# EAGLE design LoRa ST Sensor Node v1.2 (EAGLE 7.5.0)
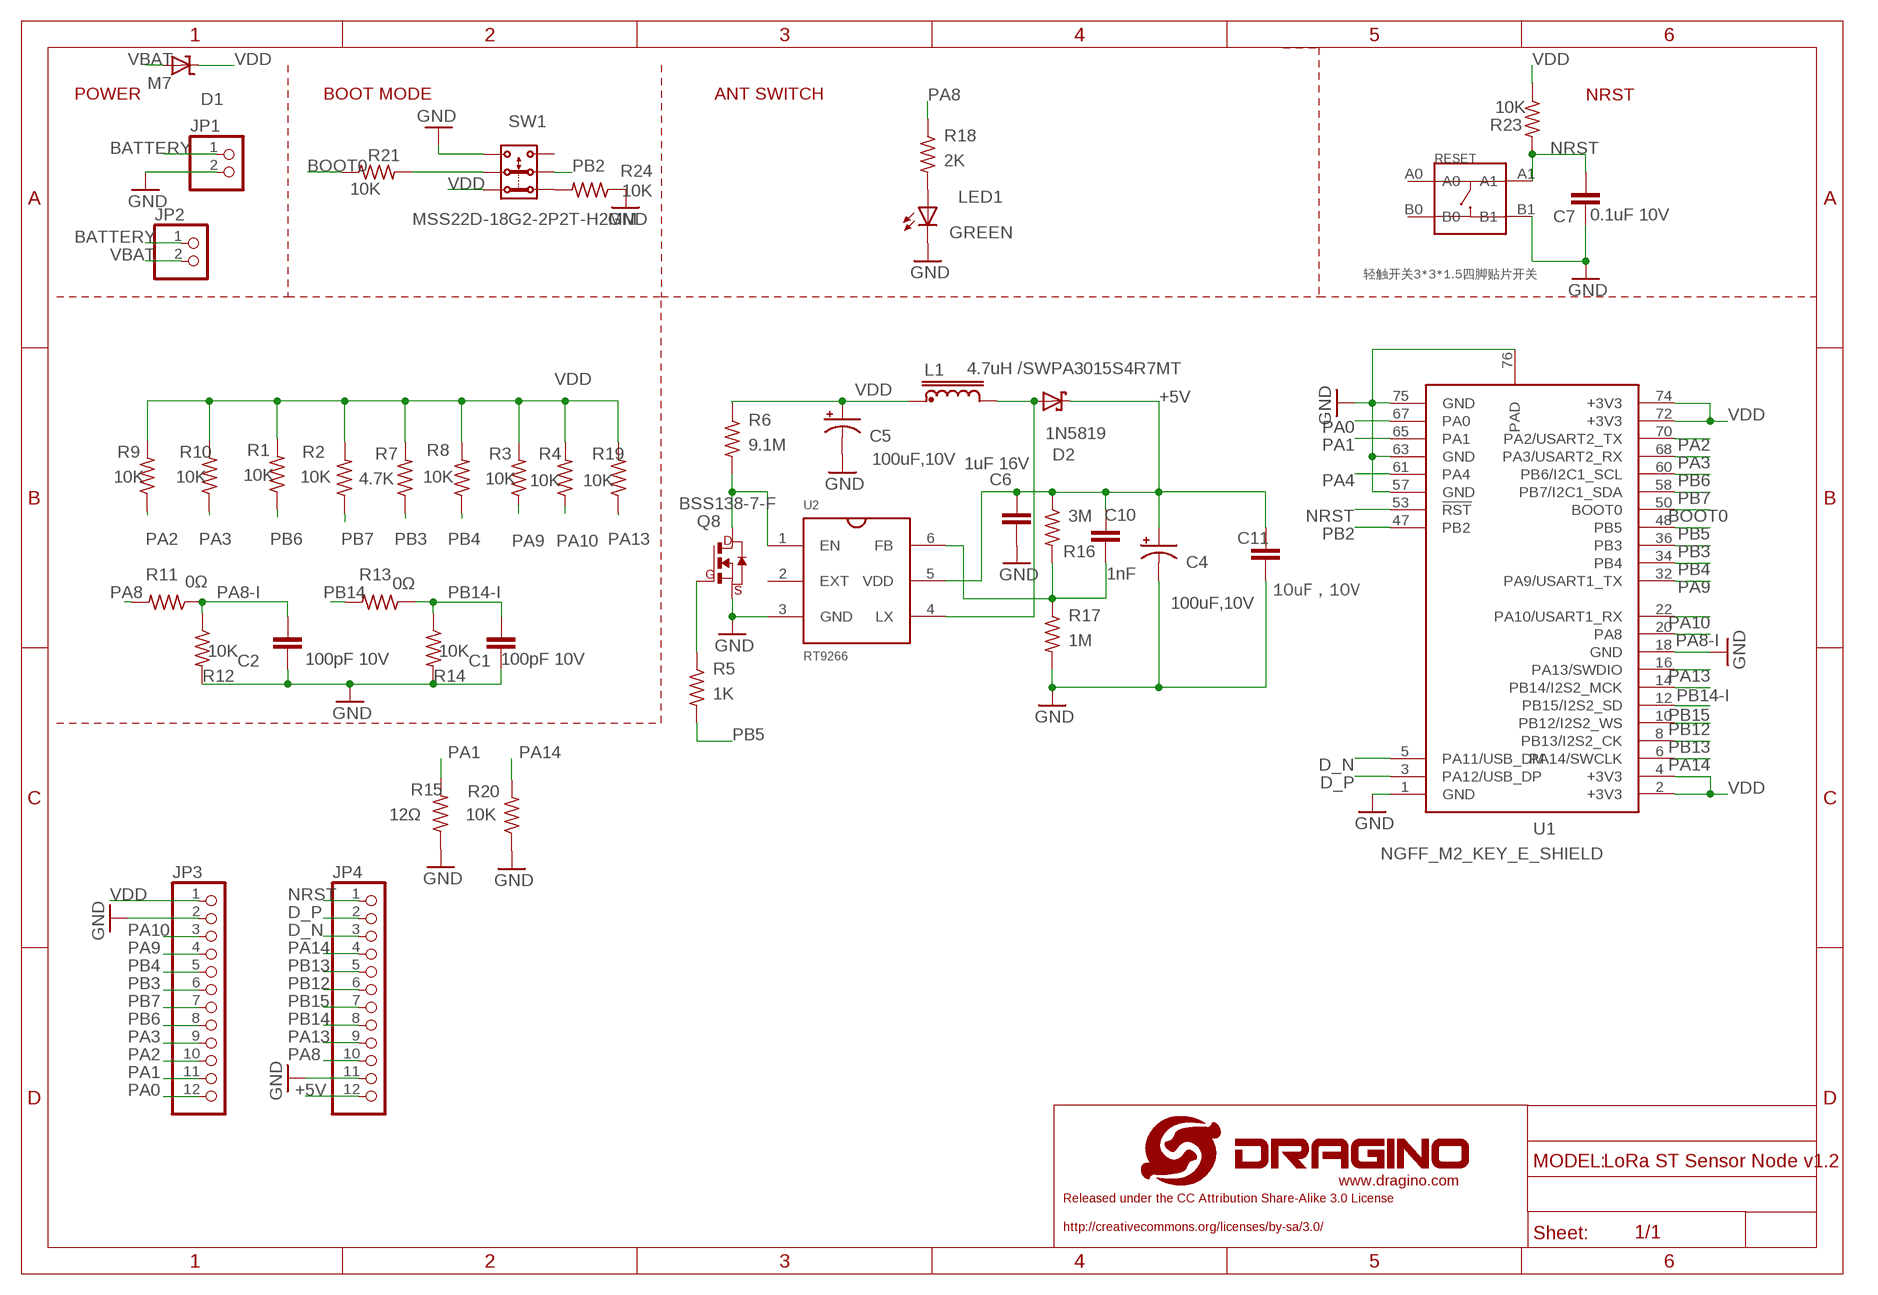
[diagram p0: schematic, sheet 1]

## Parts
C1  100pF 10V  C-EUC0603  [C0603]
C2  100pF 10V  C-EUC0603  [C0603]
C4  100uF,10V  CPOL-USSMCB  [SMC_B]
C5  100uF,10V  CPOL-USSMCB  [SMC_B]
C6  1uF 16V  C-EUC0603  [C0603]
C7  0.1uF 10V  C-EUC0402  [C0402]
C10  1nF  C-EUC0402  [C0402]
C11  10uF，10V  C-EUC0805  [C0805]
D1  M7  SCHOTTKYSMBG  [DO214AC]
D2  1N5819  SMF5.0AT1  [SOD123FL]
JP1  PINHD-1X2L  [XH2.54-2P-L]
JP2  PINHD-1X2  [1X02]
JP3  PINHD-1X12""  [1X12-DIP]
JP4  PINHD-1X12""  [1X12-DIP]
L1  4.7uH /SWPA3015S4R7MT  INDUCTORSWPA3010S  [SWPA3010S]
LED1  GREEN  LEDCHIPLED_0603  [CHIPLED_0603]
Q8  BSS138-7-F  NMOSFET  [SOT-23]
R1  10K  R-US_R0402  [R0402]
R2  10K  R-US_R0402  [R0402]
R3  10K  R-US_R0402  [R0402]
R4  10K  R-US_R0402  [R0402]
R5  1K  R-US_R0402  [R0402]
R6  9.1M  R-US_R0402  [R0402]
R7  4.7K  R-US_R0402  [R0402]
R8  10K  R-US_R0402  [R0402]
R9  10K  R-US_R0402  [R0402]
R10  10K  R-US_R0402  [R0402]
R11  0Ω  R-US_R0603  [R0603]
R12  10K  R-US_R0603  [R0603]
R13  0Ω  R-US_R0603  [R0603]
R14  10K  R-US_R0603  [R0603]
R15  12Ω  R-US_R1206  [R1206]
R16  3M  R-US_R0402  [R0402]
R17  1M  R-US_R0402  [R0402]
R18  2K  R-US_R0402  [R0402]
R19  10K  R-US_R0402  [R0402]
R20  10K  R-US_R0402  [R0402]
R21  10K  R-US_R0402  [R0402]
R23  10K  R-US_R0402  [R0402]
R24  10K  R-US_R0402  [R0402]
RESET  轻触开关3*3*1.5四脚贴片开关  BUTTON-4P-3.3X3.3  [SW4-SMD-3.35X3.35X1.5MM]
SW1  MSS22D-18G2-2P2T-H2MM  [MSS22D-18G2-2P2T-H2MM-DIL]
U1  NGFF_M2_KEY_E_SHIELD  [NGFF_M2_KEY_E_SHIELD]
U2  RT9266  [6/SOT-23]

## Nets
+5V: C4.+ C6.2 C10.2 C11.2 D2.C JP4.12 R16.1 U2.5(VDD)
BATTERY: JP1.1 JP2.1
BOOT0: R21.1 U1.50(BOOT0)
D_N: JP4.3 U1.5(PA11/USB_DM)
D_P: JP4.2 U1.3(PA12/USB_DP)
GND: C1.1 C2.1 C4.- C5.- C6.1 C7.1 C11.1 JP1.2 JP3.2 JP4.11 LED1.C Q8.2(S) R12.2 R14.2 R15.1 R17.2 R20.1 R24.1 RESET.B1 SW1.1 U1.1(GND) U1.18(GND) U1.57(GND) U1.63(GND) U1.75(GND) U1.76(PAD) U2.3(GND)
N$3: LED1.A R18.2
N$4: R24.2 SW1.4
N$5: Q8.3(G) R5.1
N$6: C10.1 R16.2 R17.1 U2.6(FB)
N$7: D2.A L1.P$2 U2.4(LX)
N$9: Q8.1(D) R6.2 U2.1(EN)
N$22: R21.2 SW1.2
NRST: C7.2 JP4.1 R23.2 RESET.A1 U1.53(!RST)
PA0: JP3.12 U1.67(PA0)
PA1: JP3.11 R15.2 U1.65(PA1)
PA2: JP3.10 R9.1 U1.70(PA2/USART2_TX)
PA3: JP3.9 R10.1 U1.68(PA3/USART2_RX)
PA4: U1.61(PA4)
PA8: JP4.10 R11.2 R18.1
PA8-I: C2.2 R11.1 R12.1 U1.20(PA8)
PA9: JP3.4 R3.1 U1.32(PA9/USART1_TX)
PA10: JP3.3 R4.1 U1.22(PA10/USART1_RX)
PA13: JP4.9 R19.1 U1.16(PA13/SWDIO)
PA14: JP4.4 R20.2 U1.6(PA14/SWCLK)
PB2: SW1.5 U1.47(PB2)
PB3: JP3.6 R7.1 U1.36(PB3)
PB4: JP3.5 R8.1 U1.34(PB4)
PB5: R5.2 U1.48(PB5)
PB6: JP3.8 R1.1 U1.60(PB6/I2C1_SCL)
PB7: JP3.7 R2.1 U1.58(PB7/I2C1_SDA)
PB12: JP4.6 U1.10(PB12/I2S2_WS)
PB13: JP4.5 U1.8(PB13/I2S2_CK)
PB14: JP4.8 R13.2
PB14-I: C1.2 R13.1 R14.1 U1.14(PB14/I2S2_MCK)
PB15: JP4.7 U1.12(PB15/I2S2_SD)
VBAT: D1.A JP2.2
VDD: C5.+ D1.C JP3.1 L1.P$1 R1.2 R2.2 R3.2 R4.2 R6.1 R7.2 R8.2 R9.2 R10.2 R19.2 R23.1 SW1.3 U1.2(+3V3) U1.4(+3V3) U1.72(+3V3) U1.74(+3V3)
Unconnected: RESET.A0 RESET.B0 SW1.6 U2.2(EXT)

## Notes on the sheet
- NRST
- POWER | BOOT MODE | ANT SWITCH

## Library data of the parts
C1 C2 C6 C7 C10 = dragino:C-EU: CAPACITOR, European symbol
C4 C5 = rcl:CPOL-US: POLARIZED CAPACITOR, American symbol
C11 = dragino-passive:C-EU: CAPACITOR, European symbol
D1 = dragino:SCHOTTKY: Suppressor diode; OC_FARNELL: unknown
D2 = diode:SMF5.0AT1: 200 W Transient Voltage Suppressor Source: Data sheet <http://www.onsemi.com/pub_link/Collateral/SMF5.0AT1-D.PDF>
JP1 JP2 = pinhead:PINHD-1X2: PIN HEADER
JP3 JP4 = pinhead:PINHD-1X12: PIN HEADER
L1 = dragino:INDUCTOR: CHOKE U15
LED1 = dragino:LED: LED OSRAM: - CHIPLED LG R971, LG N971, LY N971, LG Q971, LY Q971, LO R971, LY R971 LH N974, LH R974 LS Q976, LO Q976, LY Q976 LO Q996 - Hyper CHIPLED LW Q18S LB Q993, LB Q99A, LB R99A - SideLED LS A670, LO A670, LY A670, LG A670, LP A670 LB A673, LV A673, LT A673, LW A673 LH A674 LY A675 LS A676, LA A676, LO A676, LY A676, LW A676 LS A679, LY A679, LG A679 - Hyper Micro SIDELED® LS Y876, LA Y876, LO Y876, LY Y876 LT Y87S - SmartLED LW L88C, LW L88S LB L89C, LB L89S, LG L890 LS L89K, LO L89K, LY L89K LS L896, LA L896, LO L896, LY L896 - TOPLED LS T670, LO T670, LY T670, LG T670, LP T670 LSG T670, LSP T670, LSY T670, LOP T670, LYG T670 LG T671, LOG T671, LSG T671 LB T673, LV T673, LT T673, LW T673 LH T674 LS T676, LA T676, LO T676, LY T676, LB T676, LH T676, LSB T676, LW T676 LB T67C, LV T67C, LT T67C, LS T67K, LO T67K, LY T67K, LW E67C LS E67B, LA E67B, LO E67B, LY E67B, LB E67C, LV E67C, LT E67C LW T67C LS T679, LY T679, LG T679 LS T770, LO T770, LY T770, LG T770, LP T770 LB T773, LV T773, LT T773, LW T773 LH T774 LS E675, LA E675, LY E675, LS T675 LS T776, LA T776, LO T776, LY T776, LB T776 LHGB T686 LT T68C, LB T68C - Hyper Mini TOPLED® LB M676 - Mini TOPLED Santana® LG M470 LS M47K, LO M47K, LY M47K Source: http://www.osram.convergy.de LUXEON: - LUMILED® LXK2-PW12-R00, LXK2-PW12-S00, LXK2-PW14-U00, LXK2-PW14-V00 LXK2-PM12-R00, LXK2-PM12-S00, LXK2-PM14-U00 LXK2-PE12-Q00, LXK2-PE12-R00, LXK2-PE12-S00, LXK2-PE14-T00, LXK2-PE14-U00 LXK2-PB12-K00, LXK2-PB12-L00, LXK2-PB12-M00, LXK2-PB14-N00, LXK2-PB14-P00, LXK2-PB14-Q00 LXK2-PR12-L00, LXK2-PR12-M00, LXK2-PR14-Q00, LXK2-PR14-R00 LXK2-PD12-Q00, LXK2-PD12-R00, LXK2-PD12-S00 LXK2-PH12-R00, LXK2-PH12-S00 LXK2-PL12-P00, LXK2-PL12-Q00, LXK2-PL12-R00 Source: www.luxeon.com KINGBRIGHT: KA-3528ASYC Source: www.kingbright.com
Q8 = dragino:NMOSFET: MOS FET; OC_FARNELL: unknown; OC_NEWARK: unknown
R1-R21 R23 R24 = dragino:R-US_: RESISTOR, American symbol
RESET = dragino:BUTTON-4P: SW4-6.0X6.0X5.0MM:311020024;SW4-8.0X8.0X9.0MM:311020028;SW4-SMD-6.0X6.0X5.0MM:311020004;SW4-SMD-3.35X3.35X1.5MM:311020030;SW4-SMD-5.2X5.2X2.5MM:311020046
SW1 = dragino:MSS22D-18G2-2P2T-H2MM
U1 = dragino:NGFF_M2_KEY_E_SHIELD
U2 = dragino:RT9266

## Net classes
0 default: width 0.203 mm, clearance 0.203 mm
1 vcc: width 0.254 mm

## Board
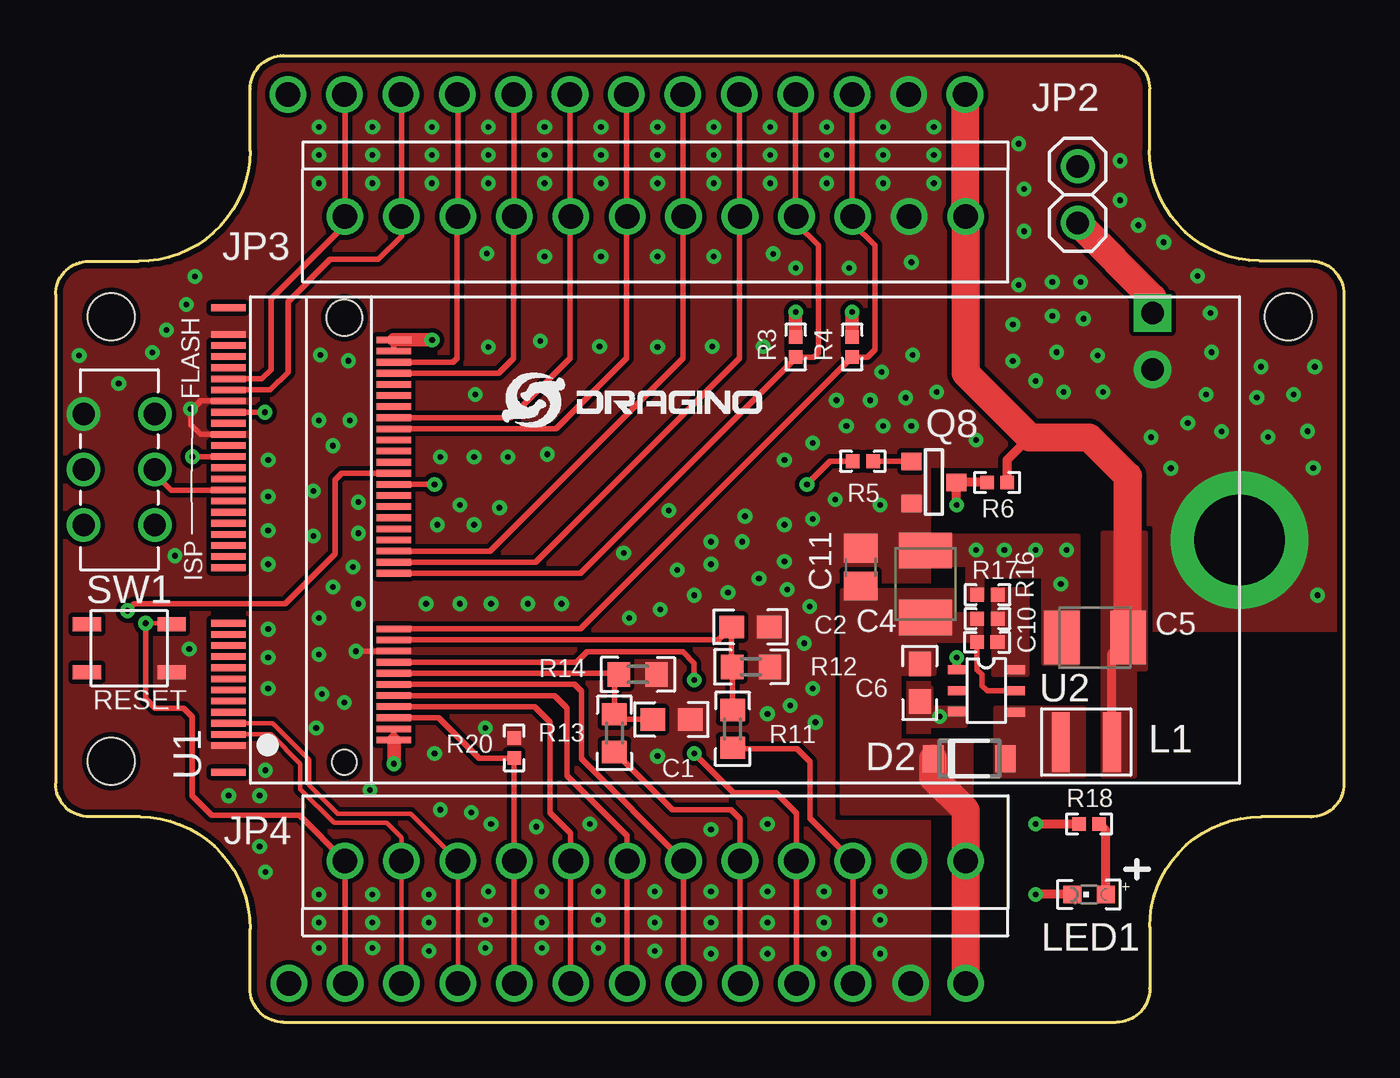
[diagram p1: board, top side]
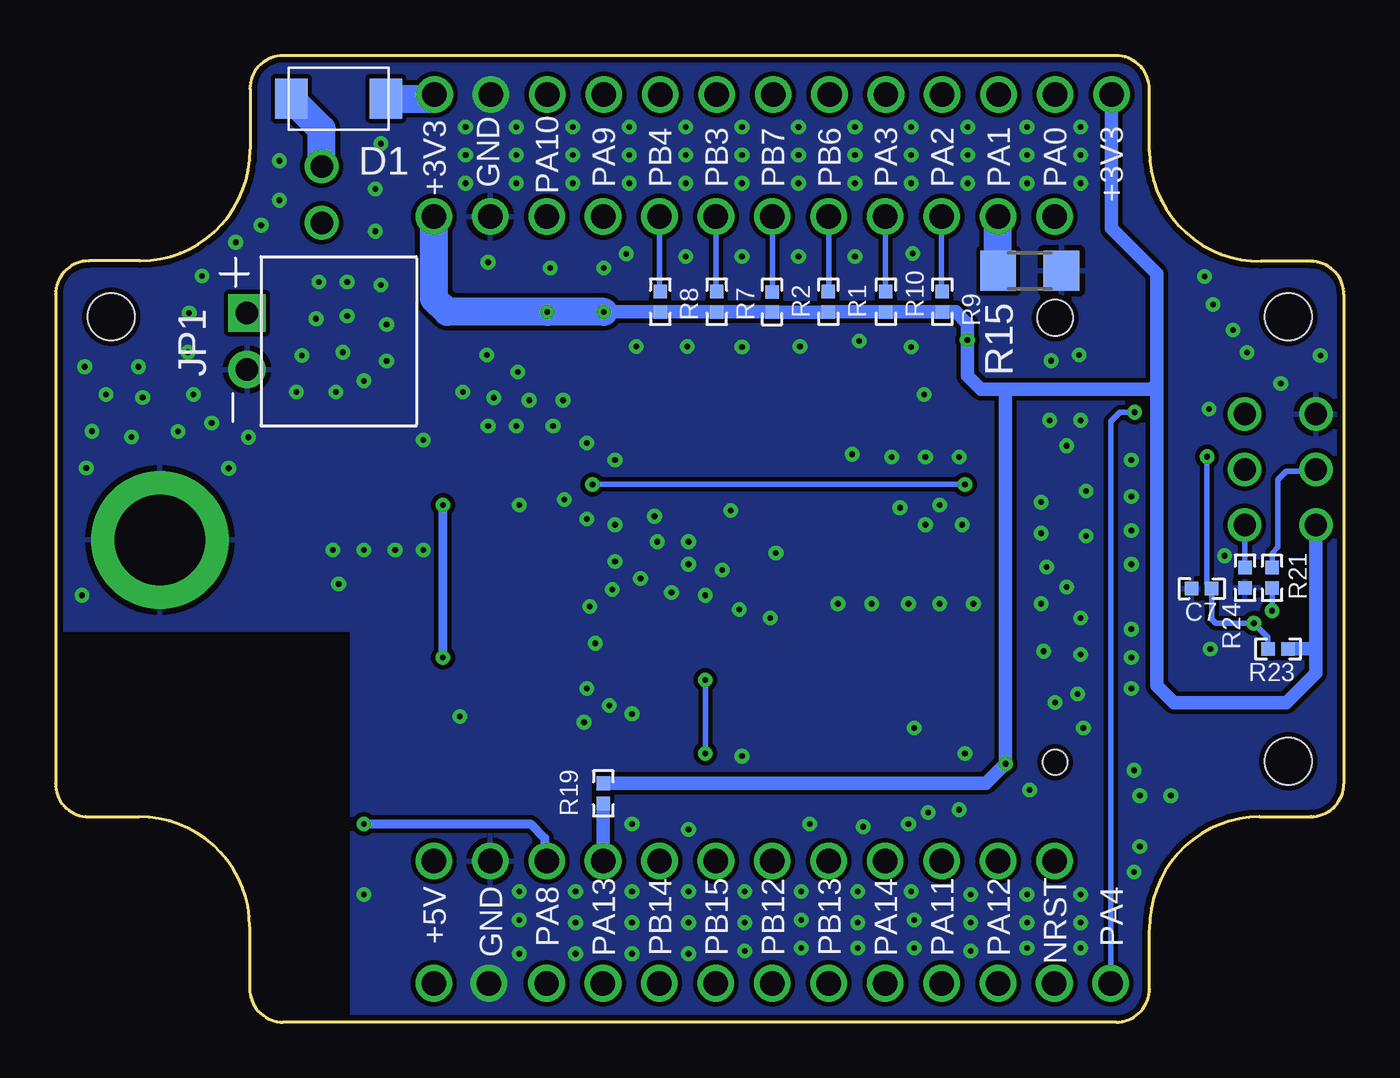
[diagram p2: board, bottom side, seen from below]

Size 58 x 43.5 mm. Coordinates in mm from the lower left corner, seen from the top.
Copper layers (1*16): Top 0.035mm / dielectric 1.5mm / Bottom 0.035mm
Design rules "default *": minimum track width 6mil, minimum drill 10mil, track to track 6mil, track to pad 10mil, pad to pad 6mil, via to via 6mil, smd to smd 6mil, copper to edge 10mil, drill to drill 8mil, minimum pad ring 10mil, minimum via ring 8mil, stop-mask expansion 4mil, vias tented up to drill 30mil, thermal gap 10mil
Holes 2.1 mm at 55.5,31.75 2.5,31.75 2.5,11.75

### Footprints (pad centres in the part's own frame; a part is rotated, then mirrored left to right if it is on the bottom)
C0603 = smd 1.1 x 1: 1 -0.85,0; 2 0.85,0
SMC_B = smd 1.6 x 2.4: + -1.5,0; - 1.5,0
C0402 = smd 0.61 x 0.61: 1 -0.457,0; 2 0.457,0
C0805 = smd 1.3 x 1.5: 1 -0.85,0; 2 0.85,0
DO214AC = smd 1.45 x 1.8: A 2.13,0; C -2.13,0
SOD123FL = smd 0.91 x 1.22: A 1.625,0; C -1.625,0
XH2.54-2P-L = drill 1 pad 1.676 square: 1 -1.27,-0.635 | drill 1 pad 1.676: 2 1.27,-0.635
1X02 = drill 1.016: 1 -1.27,0; 2 1.27,0
1X12-DIP = drill 1.1: 1 -13.97,0; 2 -11.43,0; 3 -8.89,0; 4 -6.35,0; 5 -3.81,0; 6 -1.27,0; 7 1.27,0; 8 3.81,0; 9 6.35,0; 10 8.89,0; 11 11.43,0; 12 13.97,0
SWPA3010S = smd 0.8 x 2.7: P$1 -1.15,0; P$2 1.15,0
CHIPLED_0603 = smd 0.8 x 0.8: A 0,-0.75; C 0,0.75
SOT-23 = smd 0.787 x 0.889: 1 0,-1.016; 2 -0.95,1.016; 3 0.95,1.016
R0402 = smd 0.61 x 0.61: 1 -0.457,0; 2 0.457,0
R0603 = smd 1 x 1.1: 1 -0.85,0; 2 0.85,0
R1206 = smd 1.6 x 1.803: 1 -1.422,0; 2 1.422,0
SW4-SMD-3.35X3.35X1.5MM = smd 1.27 x 0.635: A0 -1.905,1.079; A1 1.905,1.079; B0 -1.905,-1.079; B1 1.905,-1.079
MSS22D-18G2-2P2T-H2MM-DIL = drill 1: 1 -2.5,-1.6; 2 0,-1.6; 3 2.5,-1.6; 4 2.5,1.6; 5 0,1.6; 6 -2.5,1.6
NGFF_M2_KEY_E_SHIELD = smd 0.3 x 1.55: 1 1.7,-0.775; 2 1.95,-8.225; 3 2.2,-0.775; 4 2.45,-8.225; 5 2.7,-0.775; 6 2.95,-8.225; 7 3.2,-0.775; 8 3.45,-8.225; 9 3.7,-0.775; 10 3.95,-8.225; 11 4.2,-0.775; 12 4.45,-8.225; 13 4.7,-0.775; 14 4.95,-8.225; 15 5.2,-0.775; 16 5.45,-8.225; 17 5.7,-0.775; 18 5.95,-8.225; 19 6.2,-0.775; 20 6.45,-8.225; 21 6.7,-0.775; 22 6.95,-8.225; 23 7.2,-0.775; 32 9.45,-8.225; 33 9.7,-0.775; 34 9.95,-8.225; 35 10.2,-0.775; 36 10.45,-8.225; 37 10.7,-0.775; 38 10.95,-8.225; 39 11.2,-0.775; 40 11.45,-8.225; 41 11.7,-0.775; 42 11.95,-8.225; 43 12.2,-0.775; 44 12.45,-8.225; 45 12.7,-0.775; 46 12.95,-8.225; 47 13.2,-0.775; 48 13.45,-8.225; 49 13.7,-0.775; 50 13.95,-8.225; 51 14.2,-0.775; 52 14.45,-8.225; 53 14.7,-0.775; 54 14.95,-8.225; 55 15.2,-0.775; 56 15.45,-8.225; 57 15.7,-0.775; 58 15.95,-8.225; 59 16.2,-0.775; 60 16.45,-8.225; 61 16.7,-0.775; 62 16.95,-8.225; 63 17.2,-0.775; 64 17.45,-8.225; 65 17.7,-0.775; 66 17.95,-8.225; 67 18.2,-0.775; 68 18.45,-8.225; 69 18.7,-0.775; 70 18.95,-8.225; 71 19.2,-0.775; 72 19.45,-8.225; 73 19.7,-0.775; 74 19.95,-8.225; 75 20.2,-0.775; X 0.5,-0.775; Y 21.4,-0.775 | drill 4.09 pad 6.2: 76 10.95,-46.3 | hole 1.6: 20.95,-6 | hole 1.1: 0.95,-6
6/SOT-23 = smd 0.406 x 0.813: 1 -0.965,-1.372; 2 -0.015,-1.372; 3 0.911,-1.372; 4 0.937,1.27; 5 -0.015,1.27; 6 -0.965,1.27

### Placement (x,y rotation side)
C1  27.73,13.62 180 top
C2  31.29,17.79 180 top
C4  39.16,19.72 90 top
C5  46.78,17.3 180 top
C6  38.91,15.27 90 top
C7  6.41,19.51 0 bottom
C10  41.94,17.1 180 top
C11  36.24,20.48 270 top
D1  45.26,41.56 180 bottom
D2  41.13,11.86 0 top
JP1  48.75,30.64 270 bottom
JP2  46.02,37.24 90 top
JP3  27,36.25 180 top
JP4  27,7.25 0 top
L1  46.4,12.61 180 top
LED1  46.53,5.75 90 top
Q8  39.54,24.29 90 top
R1  23.21,32.42 270 bottom
R2  25.75,32.41 270 bottom
R3  33.32,30.39 90 top
R4  35.86,30.39 90 top
R5  36.34,25.24 180 top
R6  42.39,24.29 180 top
R7  28.24,32.42 270 bottom
R8  30.78,32.42 270 bottom
R9  18.08,32.42 270 bottom
R10  20.62,32.42 270 bottom
R11  30.48,13.2 270 top
R12  31.31,15.99 0 top
R13  25.16,13.01 270 top
R14  26.21,15.65 0 top
R15  14.14,33.81 180 bottom
R16  41.96,18.16 0 top
R17  41.96,19.24 180 top
R18  46.53,8.92 0 top
R19  33.35,10.29 90 bottom
R20  20.65,12.34 270 top
R21  3.24,19.99 90 bottom
R23  2.97,16.8 180 bottom
R24  4.45,20 90 bottom
RESET  3.32,16.83 0 top
SW1  2.87,24.87 270 top
U1  7,10.75 90 top
U2  41.96,14.89 270 top
U$1  [LORA_ST_SENSOR_NODE]  29,21.75 0 top
U$2  LOGO-NEW  [LOGO-SILK-NEW]  20.09,26.77 0 top

### Tracks (layer width: path | path; a pad name or v marks a point on that pad's centre or on a via)
+5V  (via drill 1.1)
  Top 0.254: U2.5 41.94,14.91 41.7,15.15 41.7,15.65 41.49,15.87 C10.2
  Top 1.27: D2.C 39.51,10.99 40.97,9.53 JP4.12 v40.98,1.75
  pour Top (no thermals): 39.54,17.18 41.66,17.18 41.66,18.33 40.45,18.33 40.45,19.41 35.43,19.41 35.43,9.42 41.21,9.42 41.21,12.63 37.97,12.63 37.97,15.7 39.54,15.7
BATTERY
  Top 1.27: JP2.1 49.39,32.61 JP1.1
BOOT0  (via drill 0.25)
  Top 0.254: v3.24,18.52 3.55,18.83 10.33,18.83 12.59,21.09 12.59,24.42 12.87,24.7 U1.50
  Bottom 0.254: R21.1 v3.24,18.52
D_N  (via drill 1.1)
  Top 0.203: U1.5 9.78,13.45 11.43,11.8 11.43,10.66 12.7,9.38 15.98,9.38 JP4.3 v18.11,1.75
D_P  (via drill 1.1)
  Top 0.203: JP4.2 | U1.3 9.7,12.95 11.02,11.63 11.02,10.49 12.54,8.97 14.91,8.97 15.57,8.31 JP4.2 | v15.57,1.75 JP4.2
GND  (via drill 0.25, 1.1)
  Top 0.254: U1.63 7.75,27.97 6.52,27.97 6.14,27.59 v6.08,27.59 6.08,26.89 6.52,26.45 U1.57 | U1.18 15.2,16.67 15.17,16.7 v13.52,16.7
  Top 0.406: LED1.C v44.12,5.75
  other vias: 38.4,41.75 38.5,1.75 31.67,19.97 29.51,20.61 27.99,20.35 19.35,4.61 27.1,30.39 19.48,30.39 32.3,34.58 33.32,33.94 32.18,39.02 32.18,40.29 29.64,40.29 29.64,39.02 27.1,40.29 27.1,39.02 24.56,39.02 24.56,40.29 22.02,40.29 22.02,39.02 19.48,39.02 19.48,40.29 16.94,40.29 16.94,39.02 29.57,30.4 31.86,30.4 22.02,34.45 24.56,34.45 27.1,34.45 29.64,34.45 35.73,33.94 38.53,34.2 39.54,39.02 34.72,40.29 39.54,40.29 34.72,39.02 16.94,37.75 19.48,37.75 22.02,37.75 24.56,37.75 27.1,37.75 29.64,37.75 32.18,37.75 34.72,37.75 37.26,37.75 37.26,39.02 37.26,40.29 25.83,18.19 27.1,11.97 5.89,32.29 39.8,13.75 41.45,21.24 42.72,21.24 44.12,21.24 45.51,21.24 6.27,33.56 5,31.15 4.36,30.13 2.84,28.73 1.06,30.01 34.21,13.49 33.07,14.26 29.51,21.62 33.96,18.7 30.91,21.62 25.57,21.11 30.27,19.34 32.81,22.39 27.61,23.02 17.32,25.43 18.21,18.83 19.61,18.83 21.26,18.83 22.78,18.83 17.19,22.39 18.84,22.39 19.99,23.15 20.37,25.43 11.73,13.24 34.08,15.02 32.05,13.88 27.23,18.57 33.7,17.05 47.93,36.99 39.54,37.75 35.16,27.99 36.68,27.99 37.19,29.26 38.59,30.02 45.06,30.15 52.05,30.15 51.8,28.24 56.37,26.59 55.73,28.24 54.59,26.34 51.41,33.58 49.89,35.1 56.62,24.94 14.27,40.29 14.27,39.02 14.27,37.75 11.86,37.75 11.86,39.02 11.86,40.29 5.38,20.99 14.27,5.75 14.27,4.48 14.27,3.34 16.81,5.75 16.81,4.48 16.81,3.21 19.35,3.34 19.48,5.88 21.89,5.88 21.89,4.48 21.89,3.34 24.43,5.88 24.43,4.61 24.43,3.34 26.97,5.88 26.97,4.48 26.97,3.21 29.51,5.88 29.51,4.48 29.51,3.08 32.05,5.88 32.05,4.48 32.05,3.08 34.59,5.88 34.59,4.48 34.59,3.08 37.13,3.08 37.13,4.61 37.13,5.88 28.75,19.21 32.81,20.73 13,14.38 13.64,18.83 50.97,26.96 52.5,26.58 50.21,24.93 54.28,29.5 51.99,31.91 56.69,29.5 56.82,19.21 11.92,30.02 18.9,28.24 21.82,30.66 24.49,30.4 32.05,8.92 29.51,8.67 13.19,29.77 19.41,34.59 45.26,19.72 6.02,16.8 31.04,22.77 35.1,23.53 37.13,23.27 34.08,22.64 32.94,19.46 34.08,26.07 35.61,26.83 37.26,26.83 38.27,28.1 39.67,28.35 38.53,26.83 49.32,26.32 47.16,28.35 45.39,28.35 43.1,29.75 43.1,31.4 43.35,33.18 44.88,33.31 46.27,31.66 44.88,31.78 46.91,30.01 44.12,28.86 46.15,33.31 32.81,25.31 54.08,28.12 13.26,27.08 12.49,25.94 13.38,20.48 11.98,14.77 11.86,16.54 11.86,18.19 12.49,19.59 11.6,23.91 11.6,21.88 16.68,18.83 9.19,7.91 18.21,23.27 22.14,25.56 18.84,25.43 11.86,27.08 11.86,5.75 11.86,4.48 11.86,3.34 9.45,11.34 7.79,10.19 9.19,10.19 41.45,26.2 19.35,13.24 18.72,9.43 14.14,10.45 17.32,9.56 19.61,8.92 9.45,6.76 17.06,12.1 21.64,8.8 24.05,8.92 9.57,17.69 9.57,16.42 9.57,15.02 9.57,25.31 9.57,23.66 9.57,22.13 9.57,20.61 13.64,23.4 13.64,22 43.61,37.5 43.61,35.59 43.35,39.53 47.93,38.77 48.75,35.86
  pour Top (rank 2, no thermals): 0.05,32.67 0.05,10.66 arc90 1.47,9.24 3.79,9.24 arc-90 8.81,4.22 8.81,1.43 arc90 10.21,0.03 39.29,0.03 39.29,25.05 47.42,25.05 47.42,17.69 57.96,17.69 57.96,32.66 arc90 56.35,34.27 54.17,34.27 arc-90 49.25,39.19 49.25,42.01 arc90 47.8,43.47 10.24,43.47 arc90 8.77,41.99 8.77,39.33 arc-90 3.67,34.23 1.61,34.23 arc90
  pour Bottom (rank 2): 0.05,32.67 0.05,10.75 arc90 1.58,9.21 3.94,9.21 arc-90 8.73,4.42 8.73,1.6 arc90 10.34,-0.01 44.62,-0.01 44.62,17.69 57.96,17.69 57.96,32.85 arc90 56.57,34.25 54.16,34.25 arc-90 49.23,39.17 49.23,42.04 arc90 47.8,43.47 10.31,43.47 arc90 8.76,41.91 8.76,39.48 arc-90 3.6,34.32 1.7,34.32 arc90
  pour Top (no thermals): 38.53,15.02 39.42,15.02 39.42,14.13 40.94,14.13 40.94,13.37 38.53,13.37
  pour Top (no thermals): 41.07,20.61 35.29,20.61 35.29,21.88 46.02,21.88 46.02,16.16 44.5,16.16 44.5,20.1 41.7,20.1 41.7,19.08 41.07,19.08
N$3
  Top 0.406: LED1.A 47.28,8.63 R18.2
N$4
  Bottom 0.254: R24.2 4.45,22.36 SW1.4
N$5
  Top 0.254: R5.1 Q8.3
  Top 0.406: R5.1
N$6
  pour Top (no thermals): 43.73,15.65 42.24,15.65 42.24,19.45 43.73,19.45
N$7
  pour Top (no thermals): 42.34,11.08 42.34,14.13 46.27,14.13 46.27,11.08
N$9  (via drill 0.25)
  Top 0.406: v40.56,23.27 Q8.1 R6.2 | v40.56,16.42 40.56,15.88 U2.1
  Bottom 0.406: v40.56,16.42 v40.56,23.27
N$22
  Bottom 0.254: R21.2 3.24,21.1 2.97,21.37 2.97,24.42 2.59,24.8 1.34,24.8 SW1.2
NRST  (via drill 0.25, 1.1)
  Top 0.203: RESET.A1 5.18,17.95 v4.06,17.95
  Top 0.254: U1.53 v6.17,25.45 | v4.06,17.95 4.06,14.56 4.49,14.13 5.76,14.13 6.14,13.75 6.14,10.19 7.03,9.3 10.98,9.3 JP4.1 v13.04,1.75
  Bottom 0.254: C7.2 5.96,19.5 | R23.2 3.43,17.32 v4.06,17.95 5.77,17.95 5.95,18.13 C7.2 | v6.17,25.45 6.17,19.73 C7.2
PA0  (via drill 1.1)
  Top 0.254: U1.67 9.28,28.95 9.7,29.37 9.7,32.55 13.03,35.88 JP3.12 13.03,41.75 v13,41.75
PA1  (via drill 1.1)
  Top 0.254: 8.14,28.45 U1.65 9.67,28.45 10.46,29.24 10.46,32.42 12.37,34.32 14.53,34.32 15.57,35.37 JP3.11 15.57,41.75 v15.54,41.75
  Bottom 1.27: R15.2 JP3.11
PA2  (via drill 1.1)
  Top 0.254: 18.11,35.94 JP3.10 | U1.70 17.9,29.7 18.08,29.88 18.08,36.22 JP3.10 | v18.08,41.75 18.11,41.75 JP3.10
  Bottom 0.254: R9.1 18.11,32.91 JP3.10
PA3  (via drill 1.1)
  Top 0.254: 20.65,35.94 JP3.9 | U1.68 19.94,29.2 20.62,29.88 20.62,36.22 JP3.9 | v20.62,41.75 20.65,41.75 JP3.9
  Bottom 0.254: R10.1 20.65,32.91 JP3.9
PA4  (via drill 0.25, 1.1)
  Top 0.254: U1.61 v9.43,27.45 9.45,27.46
  Bottom 0.254: v10.5,1.75 10.5,27.05 10.09,27.45 v9.43,27.45
PA8  (via drill 0.25, 1.1)
  Top 0.254: R11.2 30.53,12.3 33.38,12.3 33.96,11.72 33.96,9.19 JP4.10 v35.89,1.75 v35.9,1.75
  Top 0.406: v44.12,8.92 R18.1
  Bottom 0.406: v44.12,8.92 36.62,8.92 35.99,8.29 35.99,7.35 JP4.10
PA8-I
  Top 0.254: R11.1 30.48,15.97 R12.1 30.44,16.01 C2.2 29.85,17.2 U1.20
PA9  (via drill 1.1)
  Top 0.254: JP3.4 33.35,35.94 34.34,34.96 34.34,30.13 34.13,29.93 R3.1 33.32,29.88 23.64,20.2 U1.32 | 33.32,36.22 JP3.4 | v33.32,41.75 33.32,36.28 JP3.4
PA10  (via drill 1.1)
  Top 0.254: JP3.3 35.89,35.94 36.88,34.96 36.88,30.26 36.55,29.93 R4.1 23.63,17.7 U1.22 | 35.86,36.22 JP3.3 | v35.86,41.75 35.86,36.28 JP3.3
PA13  (via drill 0.25, 1.1)
  Top 0.254: v28.75,15.4 28.75,16.16 28.24,16.67 23.92,16.67 23.45,16.2 U1.16 | v28.75,12.1 30.53,10.32 32.43,10.32 33.35,9.4 JP4.9 v33.35,1.75 v33.36,1.75
  Bottom 0.254: v28.75,12.1 v28.75,15.4
  Bottom 0.406: R19.1
  Bottom 0.61: R19.1 JP4.9
PA14  (via drill 1.1)
  Top 0.254: U1.6 17.24,13.7 19.06,11.88 R20.2 JP4.4 v20.65,1.75
PB2
  Top 0.254: SW1.5 4.47,24.7 5.22,23.95 U1.47
PB3  (via drill 1.1)
  Top 0.254: 28.27,35.94 JP3.6 | U1.36 19.56,21.2 28.24,29.88 28.24,36.22 JP3.6 | v28.24,41.75 28.24,36.28 JP3.6
  Bottom 0.254: R7.1 28.27,32.91 JP3.6
PB4  (via drill 1.1)
  Top 0.254: 30.81,35.94 JP3.5 | U1.34 21.6,20.7 30.78,29.88 30.78,36.22 JP3.5 | v30.78,41.75 30.78,36.28 JP3.5
  Bottom 0.254: R8.1 30.81,32.91 JP3.5
PB5  (via drill 0.25)
  Top 0.254: v33.83,24.2 34.87,25.24 R5.2 | U1.48 v17.06,24.2
  Bottom 0.254: v33.83,24.2 v17.06,24.2
PB6  (via drill 1.1)
  Top 0.254: 23.19,35.94 JP3.8 | U1.60 20.48,27.2 23.16,29.88 23.16,36.22 JP3.8 | v23.16,41.75 23.16,36.28 JP3.8
  Bottom 0.254: R1.1 23.19,32.89 JP3.8
PB7  (via drill 1.1)
  Top 0.254: 25.73,35.94 JP3.7 | U1.58 22.52,26.7 25.7,29.88 25.7,36.22 JP3.7 | v25.7,41.75 25.7,36.28 JP3.7
  Bottom 0.254: R2.1 JP3.7
PB12  (via drill 1.1)
  Top 0.254: v25.74,1.75 v25.73,1.75 JP4.6 25.73,8.38 23.03,11.08 23.03,14.13 22.46,14.7 U1.10
PB13  (via drill 1.1)
  Top 0.254: v23.2,1.75 v23.19,1.75 JP4.5 23.19,8.51 22.27,9.43 22.27,13.49 21.57,14.2 U1.8
PB14  (via drill 1.1)
  Top 0.254: R13.2 27.76,9.56 30.4,9.56 30.81,9.14 JP4.8 v30.81,1.75 v30.82,1.75
PB14-I
  Top 0.254: U1.14 25.2,15.7 | 25.2,15.7 25.19,15.7 | R13.1 25.36,13.86 | R13.1 25.16,15.46 R14.1 25.31,15.7 25.2,15.7 | C1.2 25.4,13.62 R13.1
PB15  (via drill 1.1)
  Top 0.254: U1.12 23.36,15.2 23.67,14.89 23.67,11.85 JP4.7 v28.27,1.75 v28.28,1.75
VBAT
  Bottom 1.27: JP2.2 46.02,40.19 D1.A
VDD  (via drill 0.25, 1.1)
  Top 0.254: U1.2 U1.4 | U1.74 U1.72
  Top 0.406: L1.P$1 47.55,16.57 C5.+ | R6.1 42.85,25.31 43.86,26.32 | v16.95,30.7
  Top 0.61: v16.95,30.7 | R3.2 v33.32,31.96 | R4.2 v35.86,31.96 | U1.74 v16.95,30.7 | v15.24,11.63 15.24,12.69 U1.2
  Top 1.27: 48.31,17.3 C5.+ 48.28,24.57 46.53,26.32 43.86,26.32 40.97,29.21 JP3.1 40.94,36.28 v40.94,41.75
  Bottom 0.406: R1.2 | R2.2 25.75,31.96 | 8.43,28.86 8.81,28.48
  Bottom 0.61: R1.2 R10.2 R9.2 17.47,31.96 16.95,31.44 v16.95,30.71 v16.95,30.7 16.95,29.09 16.34,28.48 15.29,28.48 | R1.2 R2.2 | 25.75,31.96 R7.2 R8.2 v33.32,31.96 | 15.29,28.48 8.81,28.48 | v10.46,41.75 10.46,35.72 8.43,33.69 8.43,28.86 8.43,15.15 7.67,14.38 2.59,14.38 1.27,15.7 1.27,16.92 | 1.27,16.92 1.39,16.8 R23.1 | 1.27,16.92 SW1.3 | 15.29,28.48 15.24,28.43 v15.24,11.63 16.11,10.75 R19.2
  Bottom 1.27: v33.32,31.96 v35.86,31.96 40.36,31.96 40.97,32.58 JP3.1 | D1.C 41.13,41.56 v40.94,41.75
  pour Top (no thermals): 47.16,11.08 47.16,22 49.07,22 49.07,15.91 48.56,15.91 48.56,11.08

### Text on the board
tPlace: FLASH | ISP
bPlace: PA0 | PA1 | PA2 | PA3 | PB6 | PB7 | PB3 | PB4 | PA9 | PA10 | GND | +3V3 | +3V3 | NRST | PA12 | PA11 | PA14 | PB13 | PB12 | PB15 | PB14 | PA13 | PA8 | GND | +5V | PA4
tDocu: LSN50 v1.2